# Altium schematic sheet AnalogOutLevelShifter.SchDoc: Analog Out Level Shifter
size A4; Author: A. Kalberer; CompanyName: NTB; Organization: NTB Interstate University of Applied; Address1: Werdenbergstrasse 4; Address3: 9471 Buchs; Address4: Switzerland; Revision: 0.1; Organization1: Sciences of Technology Buchs; Size: A4; ShortDescription: +/-10V level shifter for analog out
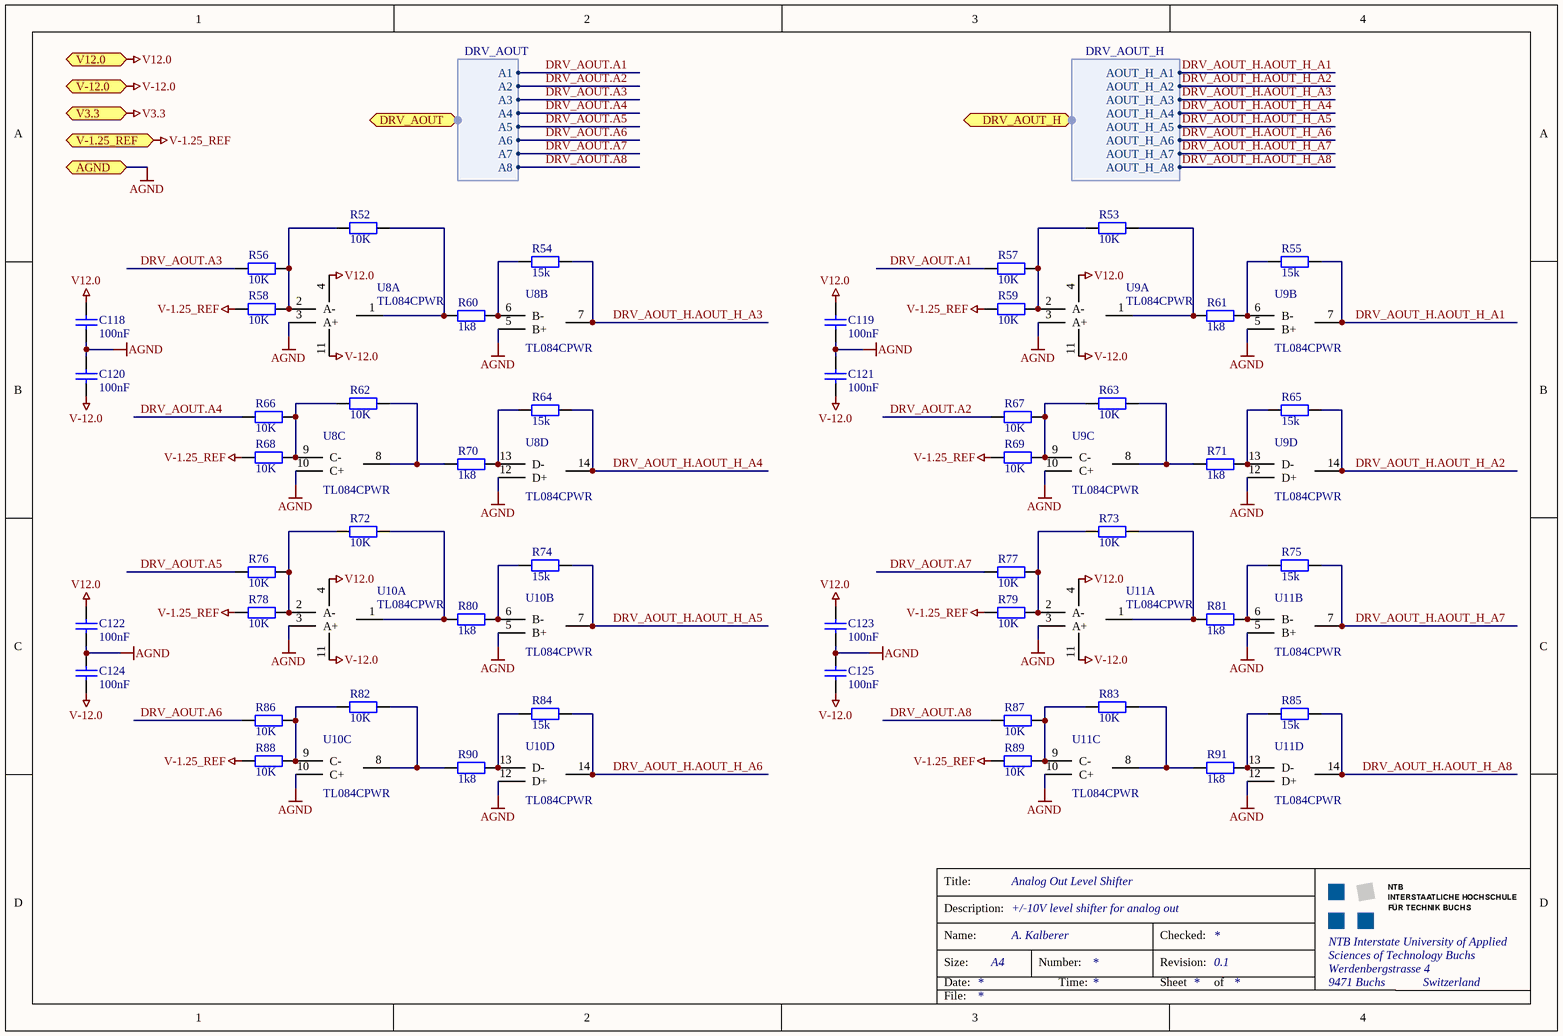
[diagram p0: AnalogOutLevelShifter.SchDoc]

## Parts
C118  100nF  [0603_3D]
C119  100nF  [0603_3D]
C120  100nF  [0603_3D]
C121  100nF  [0603_3D]
C122  100nF  [0603_3D]
C123  100nF  [0603_3D]
C124  100nF  [0603_3D]
C125  100nF  [0603_3D]
R52  10K  [0603_3D]
R53  10K  [0603_3D]
R54  15k  [0603_3D]
R55  15k  [0603_3D]
R56  10K  [0603_3D]
R57  10K  [0603_3D]
R58  10K  [0603_3D]
R59  10K  [0603_3D]
R60  1k8  [0603_3D]
R61  1k8  [0603_3D]
R62  10K  [0603_3D]
R63  10K  [0603_3D]
R64  15k  [0603_3D]
R65  15k  [0603_3D]
R66  10K  [0603_3D]
R67  10K  [0603_3D]
R68  10K  [0603_3D]
R69  10K  [0603_3D]
R70  1k8  [0603_3D]
R71  1k8  [0603_3D]
R72  10K  [0603_3D]
R73  10K  [0603_3D]
R74  15k  [0603_3D]
R75  15k  [0603_3D]
R76  10K  [0603_3D]
R77  10K  [0603_3D]
R78  10K  [0603_3D]
R79  10K  [0603_3D]
R80  1k8  [0603_3D]
R81  1k8  [0603_3D]
R82  10K  [0603_3D]
R83  10K  [0603_3D]
R84  15k  [0603_3D]
R85  15k  [0603_3D]
R86  10K  [0603_3D]
R87  10K  [0603_3D]
R88  10K  [0603_3D]
R89  10K  [0603_3D]
R90  1k8  [0603_3D]
R91  1k8  [0603_3D]
U8  TL084CPWR  [TSOP65P640X120-14N]  (parts A,B,C,D of 4)
U9  TL084CPWR  [TSOP65P640X120-14N]  (parts A,B,C,D of 4)
U10  TL084CPWR  [TSOP65P640X120-14N]  (parts A,B,C,D of 4)
U11  TL084CPWR  [TSOP65P640X120-14N]  (parts A,B,C,D of 4)

## Ports
AGND, DRV_AOUT (harness DRV_AOUT), DRV_AOUT_H (harness DRV_AOUT_H), V3.3, V12.0, V-1.25_REF, V-12.0

## Harnesses
DRV_AOUT_H: AOUT_H_A1, AOUT_H_A2, AOUT_H_A3, AOUT_H_A4, AOUT_H_A5, AOUT_H_A6, AOUT_H_A7, AOUT_H_A8
DRV_AOUT: A1, A2, A3, A4, A5, A6, A7, A8

## Nets
AGND: C118.1 C119.1 C120.2 C121.2 C122.1 C123.1 C124.2 C125.2 U8.3(A+) U8.5(B+) U8.10(C+) U8.12(D+) U9.3(A+) U9.5(B+) U9.10(C+) U9.12(D+) U10.3(A+) U10.5(B+) U10.10(C+) U10.12(D+) U11.3(A+) U11.5(B+) U11.10(C+) U11.12(D+) ; port AGND
V3.3: port V3.3
V12.0: C118.2 C119.2 C122.2 C123.2 U8.4(V+) U9.4(V+) U10.4(V+) U11.4(V+) ; port V12.0
V-1.25_REF: R58.1 R59.1 R68.1 R69.1 R78.1 R79.1 R88.1 R89.1 ; port V-1.25_REF
V-12.0: C120.1 C121.1 C124.1 C125.1 U8.11(V-) U9.11(V-) U10.11(V-) U11.11(V-) ; port V-12.0
DRV_AOUT.A1: R57.1 ; port DRV_AOUT.A1
DRV_AOUT.A2: R67.1 ; port DRV_AOUT.A2
DRV_AOUT.A3: R56.1 ; port DRV_AOUT.A3
DRV_AOUT.A4: R66.1 ; port DRV_AOUT.A4
DRV_AOUT.A5: R76.1 ; port DRV_AOUT.A5
DRV_AOUT.A6: R86.1 ; port DRV_AOUT.A6
DRV_AOUT.A7: R77.1 ; port DRV_AOUT.A7
DRV_AOUT.A8: R87.1 ; port DRV_AOUT.A8
DRV_AOUT_H.AOUT_H_A1: R55.2 U9.7(Bout) ; port DRV_AOUT_H.AOUT_H_A1
DRV_AOUT_H.AOUT_H_A2: R65.2 U9.14(Dout) ; port DRV_AOUT_H.AOUT_H_A2
DRV_AOUT_H.AOUT_H_A3: R54.2 U8.7(Bout) ; port DRV_AOUT_H.AOUT_H_A3
DRV_AOUT_H.AOUT_H_A4: R64.2 U8.14(Dout) ; port DRV_AOUT_H.AOUT_H_A4
DRV_AOUT_H.AOUT_H_A5: R74.2 U10.7(Bout) ; port DRV_AOUT_H.AOUT_H_A5
DRV_AOUT_H.AOUT_H_A6: R84.2 U10.14(Dout) ; port DRV_AOUT_H.AOUT_H_A6
DRV_AOUT_H.AOUT_H_A7: R75.2 U11.7(Bout) ; port DRV_AOUT_H.AOUT_H_A7
DRV_AOUT_H.AOUT_H_A8: R85.2 U11.14(Dout) ; port DRV_AOUT_H.AOUT_H_A8
NetR52_1: R52.1 R56.2 R58.2 U8.2(A-)
NetR52_2: R52.2 R60.1 U8.1(Aout)
NetR53_1: R53.1 R57.2 R59.2 U9.2(A-)
NetR53_2: R53.2 R61.1 U9.1(Aout)
NetR54_1: R54.1 R60.2 U8.6(B-)
NetR55_1: R55.1 R61.2 U9.6(B-)
NetR62_1: R62.1 R66.2 R68.2 U8.9(C-)
NetR62_2: R62.2 R70.1 U8.8(Cout)
NetR63_1: R63.1 R67.2 R69.2 U9.9(C-)
NetR63_2: R63.2 R71.1 U9.8(Cout)
NetR64_1: R64.1 R70.2 U8.13(D-)
NetR65_1: R65.1 R71.2 U9.13(D-)
NetR72_1: R72.1 R76.2 R78.2 U10.2(A-)
NetR72_2: R72.2 R80.1 U10.1(Aout)
NetR73_1: R73.1 R77.2 R79.2 U11.2(A-)
NetR73_2: R73.2 R81.1 U11.1(Aout)
NetR74_1: R74.1 R80.2 U10.6(B-)
NetR75_1: R75.1 R81.2 U11.6(B-)
NetR82_1: R82.1 R86.2 R88.2 U10.9(C-)
NetR82_2: R82.2 R90.1 U10.8(Cout)
NetR83_1: R83.1 R87.2 R89.2 U11.9(C-)
NetR83_2: R83.2 R91.1 U11.8(Cout)
NetR84_1: R84.1 R90.2 U10.13(D-)
NetR85_1: R85.1 R91.2 U11.13(D-)

## Notes on the sheet
- Title:
- Description:
- Size:
- Date:
- Name:
- Number:
- Time:
- Revision:
- Sheet
- Checked:
- of
- File:

## Library data of the parts
C118-C125 = C: Capacitor; #Manufacturer: Generic Components; #Publisher: Dr. A. Heinzelmann; #Class: Passive; Initial Voltage: 0V; #Published: 2006-10-07; #ClassSub: Capacitor; Type: *; Value: 100nF; Voltage Maximum: *
R52-R91 = R: Resistor; #Manufacturer: Generic Components; #Publisher: Dr. A. Heinzelmann; #Class: Passive; #Published: 2006-10-06; #ClassSub: Resistor
  R52 R53 R56-R59 R62 R63 R66-R69 R72 R73 R76-R79 R82 R83 R86-R89: Value: 10K
  R54 R55 R64 R65 R74 R75 R84 R85: Value: 15k
  R60 R61 R70 R71 R80 R81 R90 R91: Value: 1k8
U8-U11 = TL084CPWR: Quad OPAmp